# Altium schematic sheet Test_Board_PCB.SchDoc
size A4
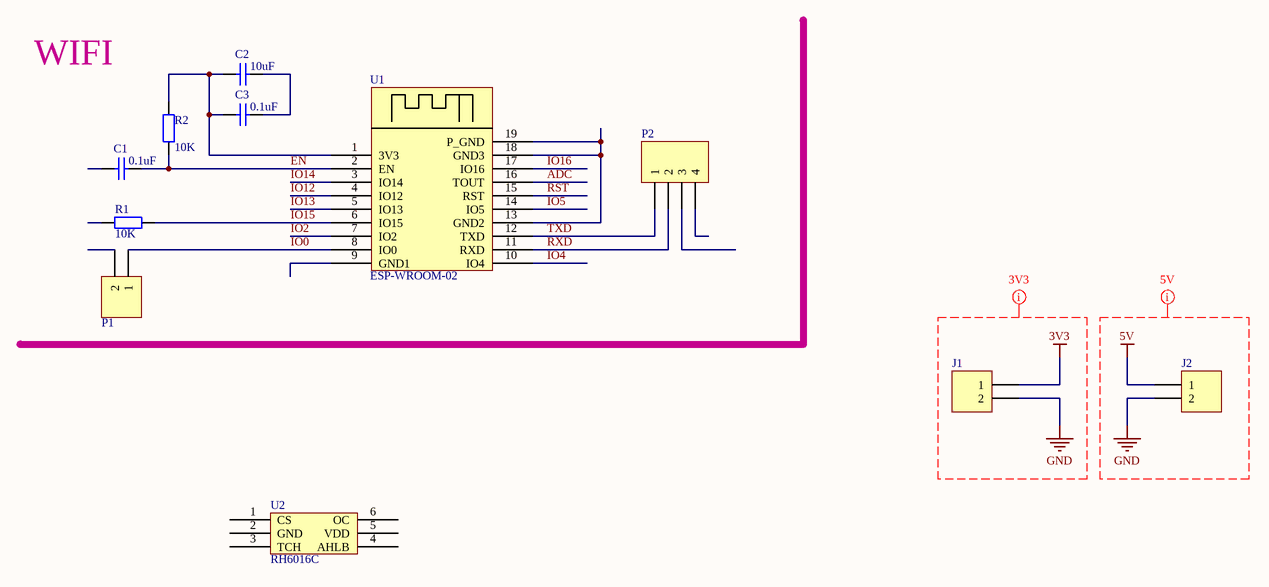
[diagram p0: Test_Board_PCB.SchDoc]

## Parts
C1  value 0.1uF  [C-0603]  (hidden comment: Cap)
C2  value 10uF  [C-0805]  (hidden comment: Cap)
C3  value 0.1uF  [C-0603]  (hidden comment: Cap)
J1  Header 2  [HDR1X2]  (value not drawn)
J2  Header 2  [HDR1X2]  (value not drawn)
P1  Header 2  [P1-2,header]  (value not drawn)
P2  Header 4  [P1-4,header]  (value not drawn)
R1  value 10K  [R-0603]  (hidden comment: Res2)
R2  value 10K  [R-0603]  (hidden comment: Res2)
U1  ESP-WROOM-02  [ESP-WROOM-02]
U2  RH6016C  [SOT-23-6]

## Nets
3V3: J1.1
5V: J2.1
GND: J1.2 J2.2
ADC: U1.16(TOUT)
EN: C1.2 R2.1 U1.2(EN)
IO0: P1.1 U1.8(IO0)
IO2: U1.7(IO2)
IO4: U1.10(IO4)
IO5: U1.14(IO5)
IO12: U1.4(IO12)
IO13: U1.5(IO13)
IO14: U1.3(IO14)
IO15: R1.1 U1.6(IO15)
IO16: U1.17(IO16)
RST: U1.15(RST)
RXD: P2.2 U1.11(RXD)
TXD: P2.1 U1.12(TXD)
NetC2_1: C2.1 C3.1 R2.2 U1.1(3V3)
NetC2_2: C2.2 C3.2
NetU1_13: U1.13(GND2) U1.18(GND3) U1.19(P_GND)

Not connected (* = marked no-connect by the designer): C1 1; P1 2; P2 3 4; R1 2; U1 9(GND1); U2 1(CS) 2(GND) 3(TCH) 4(AHLB) 5(VDD) 6(OC)

## Layout directives
net class 3V3: 3V3, GND
net class 5V: 5V, GND

## Notes on the sheet
- WIFI

## Library data of the parts
C1-C3 = Cap: Capacitor; Published: 8-Jun-2000; LatestRevisionDate: 17-Jul-2002; LatestRevisionNote: Re-released for DXP Platform.; PackageReference: RAD-0.3; Publisher: Altium Limited; PackageDescription: Radial Cap, Thru-Hole; 2 Leads; 0.3 in Pin Spacing
J1 J2 P1 = Header 2: Header, 2-Pin; LatestRevisionDate: 17-Jul-2002; LatestRevisionNote: Re-released for DXP Platform.; Publisher: Altium Limited
P2 = Header 4: Header, 4-Pin; LatestRevisionDate: 17-Jul-2002; LatestRevisionNote: Re-released for DXP Platform.; Publisher: Altium Limited
R1 R2 = Res2: Resistor; Published: 8-Jun-2000; LatestRevisionDate: 17-Jul-2002; LatestRevisionNote: Re-released for DXP Platform.; PackageReference: AXIAL-0.4; Publisher: Altium Limited; PackageDescription: Axial Device, Thru-Hole; 2 Leads; 0.4 in Pin Spacing